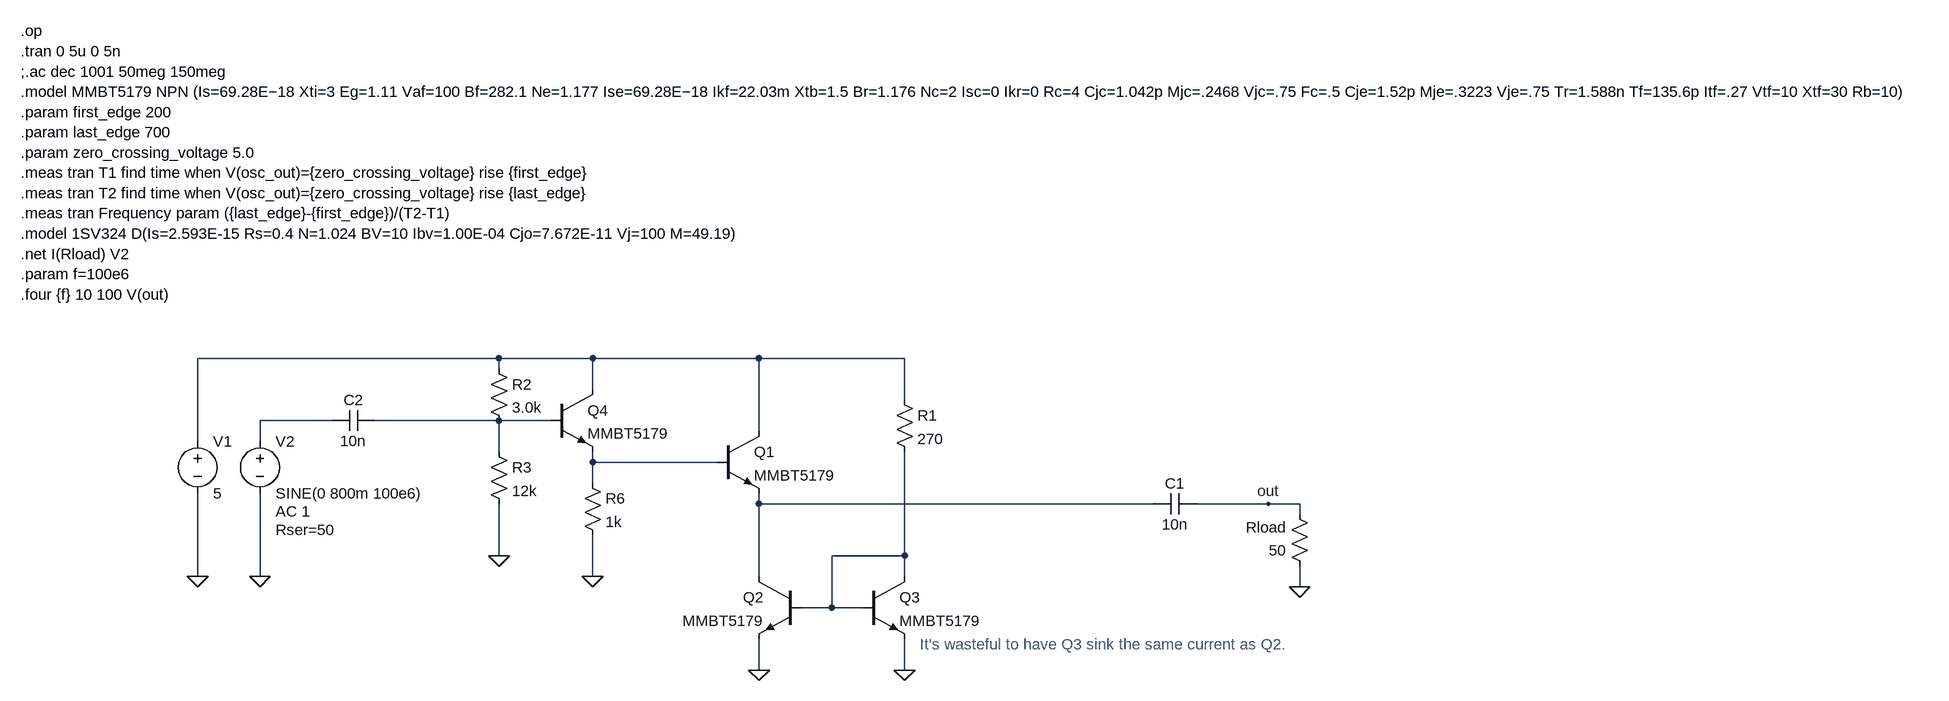
[diagram p0: schematic CC-buffer.asc]
CC-buffer.asc, the LTspice schematic file:
Version 4
SHEET 1 2708 996
WIRE 192 -16 -272 -16
WIRE 336 -16 192 -16
WIRE 592 -16 336 -16
WIRE 816 -16 592 -16
WIRE 192 0 192 -16
WIRE 336 32 336 -16
WIRE 816 48 816 -16
WIRE -64 80 -176 80
WIRE 192 80 0 80
WIRE 272 80 192 80
WIRE 592 96 592 -16
WIRE -272 112 -272 -16
WIRE -176 112 -176 80
WIRE 192 128 192 80
WIRE 336 144 336 128
WIRE 528 144 336 144
WIRE 336 176 336 144
WIRE 592 208 592 192
WIRE 1200 208 592 208
WIRE 1376 208 1264 208
WIRE 1424 208 1376 208
WIRE 1424 224 1424 208
WIRE 192 288 192 208
WIRE 816 288 816 128
WIRE 816 288 704 288
WIRE -272 320 -272 192
WIRE -176 320 -176 192
WIRE 336 320 336 256
WIRE 592 320 592 208
WIRE 816 320 816 288
WIRE 1424 336 1424 304
WIRE 704 368 704 288
WIRE 704 368 656 368
WIRE 752 368 704 368
WIRE 592 464 592 416
WIRE 816 464 816 416
FLAG -272 320 0
FLAG 1424 336 0
FLAG -176 320 0
FLAG 592 464 0
FLAG 1376 208 out
FLAG 816 464 0
FLAG 336 320 0
FLAG 192 288 0
DATAFLAG 704 208 ""
DATAFLAG 448 144 ""
DATAFLAG 80 80 ""
SYMBOL voltage -272 96 R0
SYMATTR InstName V1
SYMATTR Value 5
SYMBOL npn 528 96 R0
SYMATTR InstName Q1
SYMATTR Value MMBT5179
SYMBOL res 1440 320 R180
WINDOW 0 36 76 Left 2
WINDOW 3 36 40 Left 2
SYMATTR InstName Rload
SYMATTR Value 50
SYMBOL cap 1264 192 R90
WINDOW 0 0 32 VBottom 2
WINDOW 3 32 32 VTop 2
SYMATTR InstName C1
SYMATTR Value 10n
SYMBOL voltage -176 96 R0
WINDOW 123 24 124 Left 2
WINDOW 39 24 152 Left 2
SYMATTR Value2 AC 1
SYMATTR SpiceLine Rser=50
SYMATTR InstName V2
SYMATTR Value SINE(0 800m 100e6)
SYMBOL cap 0 64 R90
WINDOW 0 0 32 VBottom 2
WINDOW 3 32 32 VTop 2
SYMATTR InstName C2
SYMATTR Value 10n
SYMBOL npn 656 320 M0
SYMATTR InstName Q2
SYMATTR Value MMBT5179
SYMBOL npn 752 320 R0
SYMATTR InstName Q3
SYMATTR Value MMBT5179
SYMBOL res 800 32 R0
SYMATTR InstName R1
SYMATTR Value 270
SYMBOL npn 272 32 R0
SYMATTR InstName Q4
SYMATTR Value MMBT5179
SYMBOL res 320 160 R0
SYMATTR InstName R6
SYMATTR Value 1k
SYMBOL res 176 -16 R0
SYMATTR InstName R2
SYMATTR Value 3.0k
SYMBOL res 176 112 R0
SYMATTR InstName R3
SYMATTR Value 12k
TEXT -544 -520 Left 2 !.op\n.tran 0 5u 0 5n\n;.ac dec 1001 50meg 150meg\n.model MMBT5179 NPN (Is=69.28E−18 Xti=3 Eg=1.11 Vaf=100 Bf=282.1 Ne=1.177 Ise=69.28E−18 Ikf=22.03m Xtb=1.5 Br=1.176 Nc=2 Isc=0 Ikr=0 Rc=4 Cjc=1.042p Mjc=.2468 Vjc=.75 Fc=.5 Cje=1.52p Mje=.3223 Vje=.75 Tr=1.588n Tf=135.6p Itf=.27 Vtf=10 Xtf=30 Rb=10)\n.param first_edge 200\n.param last_edge 700\n.param zero_crossing_voltage 5.0\n.meas tran T1 find time when V(osc_out)={zero_crossing_voltage} rise {first_edge}\n.meas tran T2 find time when V(osc_out)={zero_crossing_voltage} rise {last_edge}\n.meas tran Frequency param ({last_edge}-{first_edge})/(T2-T1)\n.model 1SV324 D(Is=2.593E-15 Rs=0.4 N=1.024 BV=10 Ibv=1.00E-04 Cjo=7.672E-11 Vj=100 M=49.19)\n.net I(Rload) V2\n.param f=100e6\n.four {f} 10 100 V(out)
TEXT 840 424 Left 2 ;It's wasteful to have Q3 sink the same current as Q2.

The netlist it stands for:
* CC-buffer.asc
V1 N001 0 5
Q1 N001 N004 N005 0 MMBT5179
Rload 0 out 50
C1 out N005 10n
V2 N002 0 SINE(0 800m 100e6) AC 1 Rser=50
C2 N003 N002 10n
Q2 N005 N006 0 0 MMBT5179
Q3 N006 N006 0 0 MMBT5179
R1 N001 N006 270
Q4 N001 N003 N004 0 MMBT5179
R6 N004 0 1k
R2 N001 N003 3.0k
R3 N003 0 12k
.model NPN NPN
.model PNP PNP
.lib standard.bjt
.op
.tran 0 5u 0 5n
;.ac dec 1001 50meg 150meg
.model MMBT5179 NPN (Is=69.28E−18 Xti=3 Eg=1.11 Vaf=100 Bf=282.1 Ne=1.177 Ise=69.28E−18 Ikf=22.03m Xtb=1.5 Br=1.176 Nc=2 Isc=0 Ikr=0 Rc=4 Cjc=1.042p Mjc=.2468 Vjc=.75 Fc=.5 Cje=1.52p Mje=.3223 Vje=.75 Tr=1.588n Tf=135.6p Itf=.27 Vtf=10 Xtf=30 Rb=10)
.param first_edge 200
.param last_edge 700
.param zero_crossing_voltage 5.0
.meas tran T1 find time when V(osc_out)={zero_crossing_voltage} rise {first_edge}
.meas tran T2 find time when V(osc_out)={zero_crossing_voltage} rise {last_edge}
.meas tran Frequency param ({last_edge}-{first_edge})/(T2-T1)
.model 1SV324 D(Is=2.593E-15 Rs=0.4 N=1.024 BV=10 Ibv=1.00E-04 Cjo=7.672E-11 Vj=100 M=49.19)
.net I(Rload) V2
.param f=100e6
.four {f} 10 100 V(out)
* It's wasteful to have Q3 sink the same current as Q2.
.backanno
.end